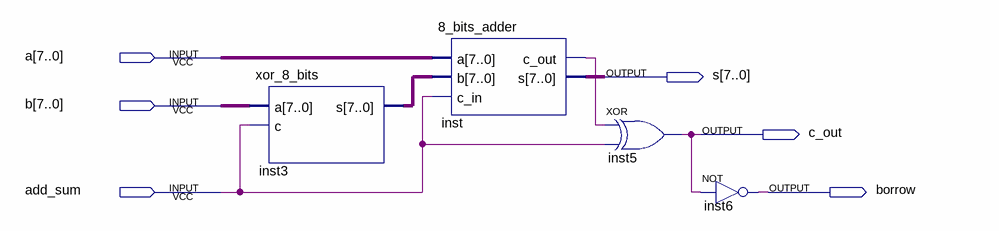
[diagram p0: schematic sheet]
// Quartus schematic lepm_tp02.bdf as structural Verilog: 4 symbols, 6 pins
module lepm_tp02 (
  input  [7:0] a,
  input  [7:0] b,
  input  add_sum,
  output [7:0] s,
  output c_out,
  output borrow
);

  wire inst_c_out;
  wire [7:0] inst3_s;

  xor_8_bits inst3 (.a(b), .c(add_sum), .s(inst3_s));
  \8_bits_adder  inst (.a(a), .b(inst3_s), .c_in(add_sum), .c_out(inst_c_out), .s(s));
  xor inst5 (c_out, inst_c_out, add_sum);
  not inst6 (borrow, c_out);
endmodule
